# Altium schematic sheet Buck Converter.SchDoc
size 457 x 241 mm; SheetNumber: 3; SheetTotal: 7; SPICEModelCacheVIQWTICF: <root> / <DocumentId>VIQWTICF</DocumentId> / <CacheFrame Number="0"> / <Model Name="cap" Kind="MDL"> / <Text>*Default semiconductor capacitor / .MODEL CAP C()</Text> / </Model> / <Model Name="res" Kind="MDL"> / <Text>*Default semiconductor resistor / .MODEL RES R()</Text> / </Model> / </CacheFrame> / </root>
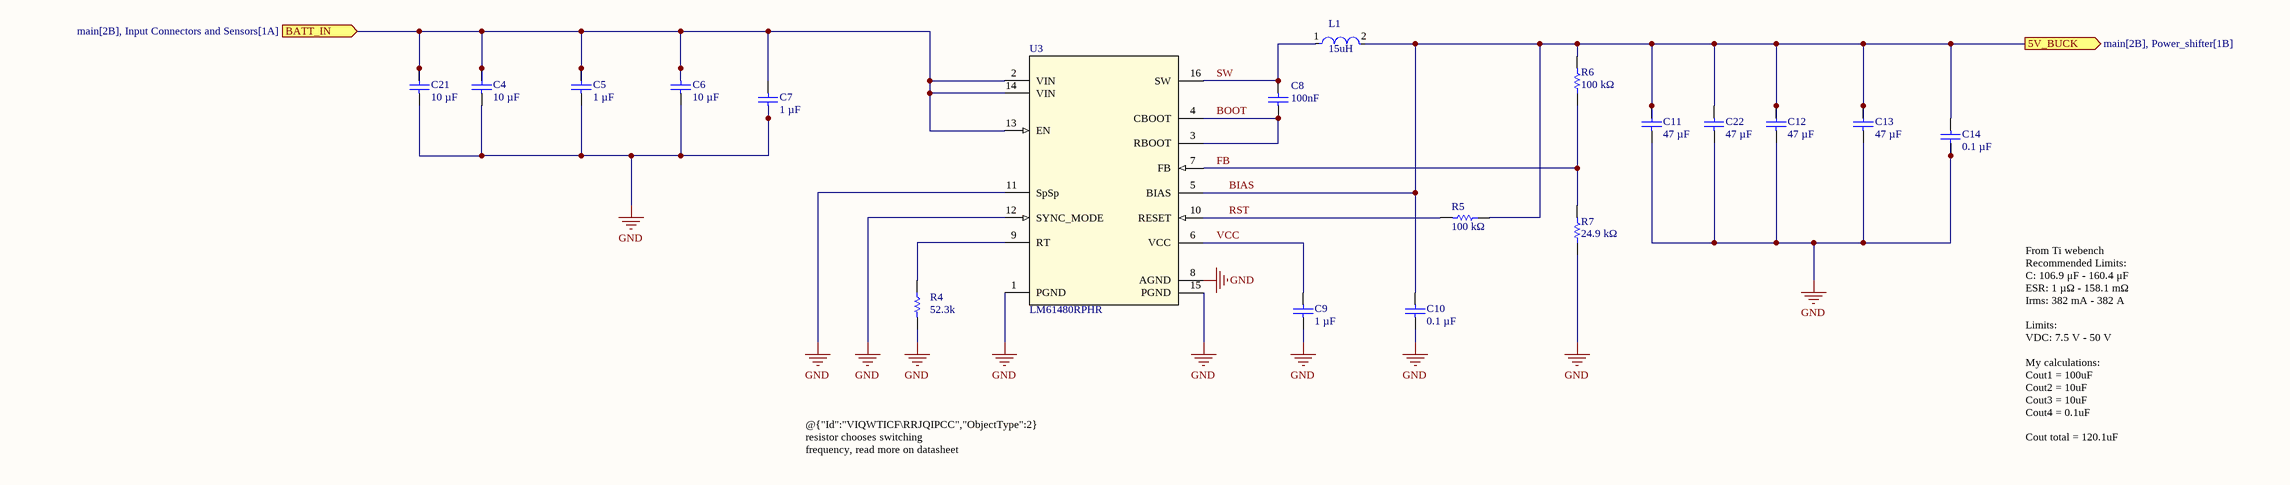
[diagram p0: Buck Converter.SchDoc]

## Parts
C4  10 µF  [1210_CAPC3225L]
C5  1 µF  [0603_CAPC1608L]
C6  10 µF  [1210_CAPC3225L]
C7  1 µF  [0603_CAPC1608L]
C8  Capacitance: 100nF  [CAPC1005X55X25LL05T10]  (hidden comment: GRM155R71A104KA01D)
C9  1 µF  [0603_CAPC1608L]
C10  0.1 µF  [0402_CAPC1005L]
C11  47 µF  [1210_CAPC3225L]
C12  47 µF  [1210_CAPC3225L]
C13  47 µF  [1210_CAPC3225L]
C14  0.1 µF  [0402_CAPC1005L]
C21  10 µF  [1210_CAPC3225L]
C22  47 µF  [1210_CAPC3225L]
L1  Inductance: 15uH  [FP-SRR1260-MFG]  (hidden comment: SRR1260-150M)
R4  Resistance: 52.3k  [RESC1005X40X25LL05T05]  (hidden comment: CRCW040252K3FKED)
R5  value 100 kΩ  [0603_RESC1608L]  (hidden comment: Res Semi)
R6  value 100 kΩ  [0603_RESC1608L]  (hidden comment: Res Semi)
R7  value 24.9 kΩ  [0603_RESC1608L]  (hidden comment: Res Semi)
U3  LM61480RPHR  [RPH0016A]

## Ports
5V_BUCK (out, see main[2B], Power_shifter[1B]), BATT_IN (in, see main[2B], Input Connectors and Sensors[1A])

## Nets
GND: C4.2 C5.2 C6.2 C7.2 C9.2 C10.2 C11.2 C12.2 C13.2 C14.2 C21.2 C22.2 R4.2 R7.1 U3.1(PGND) U3.8(AGND) U3.11(SpSp) U3.12(SYNC_MODE) U3.15(PGND)
BATT_IN: C4.1 C5.1 C6.1 C7.1 C21.1 U3.2(VIN) U3.13(EN) U3.14(VIN) ; port BATT_IN
BIAS: C10.1 C11.1 C12.1 C13.1 C14.1 C22.1 L1.2 R5.1 R6.2 U3.5(BIAS) ; port 5V_BUCK
BOOT: C8.2 U3.3(RBOOT) U3.4(CBOOT)
FB: R6.1 R7.2 U3.7(FB)
RST: R5.2 U3.10(RESET)
SW: C8.1 L1.1 U3.16(SW)
VCC: C9.1 U3.6(VCC)
NetR4_1: R4.1 U3.9(RT)

## Notes on the sheet
- @{"Id":"VIQWTICF\RRJQIPCC","ObjectType":2} resistor chooses switching frequency, read more on datasheet
- From Ti webench
  Recommended Limits:
  C: 106.9 μF - 160.4 μF
  ESR: 1 µΩ - 158.1 mΩ
  Irms: 382 mA - 382 A
  Limits:
  VDC: 7.5 V - 50 V
  My calculations:
  Cout1 = 100uF
  Cout2 = 10uF
  Cout3 = 10uF
  Cout4 = 0.1uF
  Cout total = 120.1uF

## Library data of the parts
C4-C7 C9-C14 C21 C22 = Cap Semi: Capacitor (Semiconductor SIM Model); Published: 8-Jun-2000; LatestRevisionDate: 29-May-2009; LatestRevisionNote: IPC-7351 Footprint Added.; PackageReference: C1206; Publisher: Altium Limited; PackageDescription: Chip Capacitor; Digikey part#: *; Manufacturer: *; Manufacturer part#: *
  C4 C6 C21: Value: 10 µF
  C5 C7 C9: Value: 1 µF
  C10 C14: Value: 0.1 µF
  C11-C13 C22: Value: 47 µF
C8 = CMP-2000-06331-1: Chip Capacitor, 0.1 uF, +/- 10%, 10 V, -55 to 125 degC, 0402 (1005 Metric), RoHS, Tape and Reel; Manufacturer: Murata; Rated Voltage: 10V; Dielectric: X7R; Value: 100nF; Manufacturer URL: http://www.murata.com/; Datasheet Version: 02/2016; Datasheet URL: http://search.murata.co.jp/Ceramy/image/img/A01X/G101/ENG/GRM155R71A104KA01-01.pdf; Package Reference: 0402; Tolerance (%): ±10%; Package Description: 2-Pin Surface Mount Device, Body 1 x 0.5 mm; Mounting Technology: SurfaceMount; Case Size/Dimension: 0402
L1 = CMP-2000-07146-2: FIXED IND 15UH 5A 27 MOHM SMD; Q Factor: 25; Sample Rate (Hz): 100kHz; Resistance: 27MR; Material: Steel; Inductance Tolerance: 20%; Frequency: 17.6MHz; Saturation Current: 4.6A; Core Material: Ferrite; Shielding: Shielded; Series: SRR1260; Termination: SMD/SMT; Packaging: Tape and Reel; RoHS Compliant: Yes; Height - Seated (Max): 0.256inch; Depth: 12.8mm; Case/Package: 1260; Height: 6mm; Number of Pins: 2; Mount: Surface Mount; Min Operating Temperature: -40°C; Test Frequency: 100kHz; Length: 12.5mm; Self Resonant Frequency: 17.6MHz; Current Rating: 5A; Tolerance: 20%; RMS Current (Irms): 5A; REACH SVHC: No SVHC; Resistor Type: Wirewound; DC Resistance (DCR): 27mR; Width: 12.5mm; Package Quantity: 600; DC Current: 5A; Max DC Current: 5A; Max Operating Temperature: 125°C; Military Standard: Not; Value: 15uH; Parameter 1: *
R4 = CMP-2002-00086-1: Manufacturer: Vishay Dale; Part Number: CRCW040252K3FKED
R5-R7 = Res Semi: Semiconductor Resistor; Published: 8-Jun-2000; LatestRevisionDate: 17-Jul-2002; LatestRevisionNote: Re-released for DXP Platform.; PackageReference: AXIAL-0.5; Publisher: Altium Limited; Digikey part#: *; Manufacturer: *; Manufacturer part#: *
U3 = LM61480RPHR: 8-A buck converter optimized for power density and low EMI 16-VQFN-HR -40 to 150; Manufacturer_Name: Texas Instruments; TYPE: TYPE; RefDes: RefDes; Copyright: Copyright (C) 2026 Ultra Librarian. All rights reserved.; Manufacturer_Part_Number: LM61480RPHR